# Altium schematic sheet Power_Supply.SchDoc
size A4
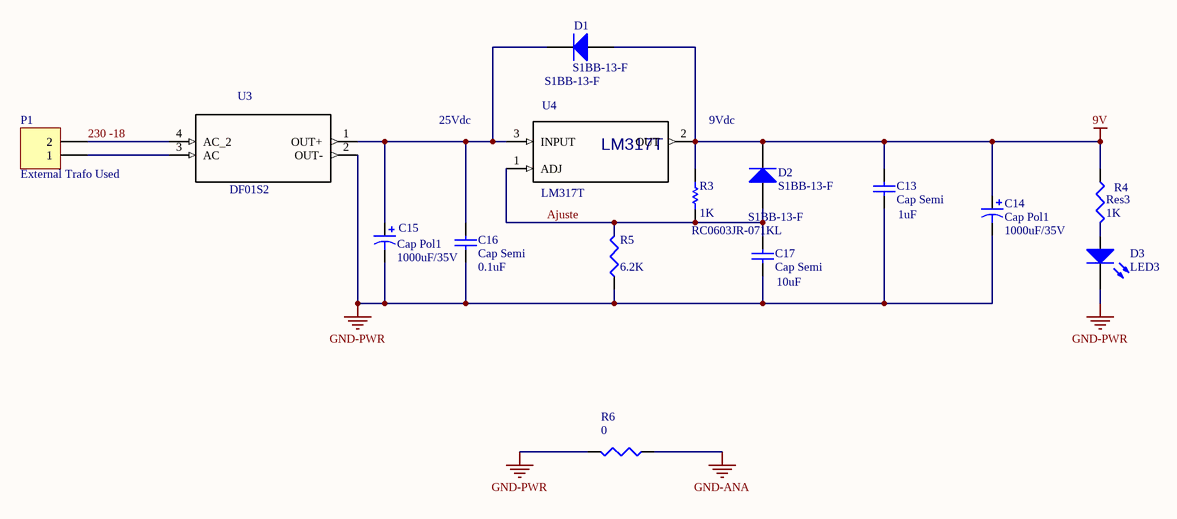
[diagram p0: Power_Supply.SchDoc]

## Parts
C13  Cap Semi  value 1uF  [1608[0603]]
C14  Cap Pol1  value 1000uF/35V  [RB7.6-15]
C15  Cap Pol1  value 1000uF/35V  [RB7.6-15]
C16  Cap Semi  value 0.1uF  [1608[0603]]
C17  Cap Semi  value 10uF  [1608[0603]]
D1  S1BB-13-F  [DIOM505270X240]
D2  S1BB-13-F  [DIOM505270X240]
D3  LED3  [6-0805_L]
P1  External Trafo Used  [PCBComponent_1]
R3  value 1K  PN: RC0603JR-071KL  [J1-0603]  (hidden comment: Res1)
R4  Res3  value 1K  [J1-0603]
R5  value 6.2K  [J1-0603]  (hidden comment: Res3)
R6  value 0  [6-0805_N]  (hidden comment: Res3)
U3  DF01S2  [SOT508P985X260-4N]
U4  LM317T  [TO254P460X1020X1945-3P]

## Nets
9V: C13.2 C14.1 D1.1(A) D2.2(K) R3.1 R4.1 U4.2(OUT)
GND-ANA: R6.1
GND-PWR: C13.1 C14.2 C15.2 C16.1 C17.1 D3.2(K) R5.1 R6.2 U3.2(OUT-)
230 -18: P1.2 U3.4(AC_2)
Ajuste: C17.2 D2.1(A) R3.2 R5.2 U4.1(ADJ)
NetC15_1: C15.1 C16.2 D1.2(K) U3.1(OUT+) U4.3(INPUT)
NetD3_1: D3.1(A) R4.2
NetP1_1: P1.1 U3.3(AC)

## Notes on the sheet
- 25Vdc
- 9Vdc

## Library data of the parts
C13 = Cap Semi: Capacitor (Semiconductor SIM Model) C1608JB1V105K080AB; PN: CL10A105KL8NNNC; Published: 8-Jun-2000; LatestRevisionDate: 29-May-2009; LatestRevisionNote: IPC-7351 Footprint Added.; PackageReference: C1206; Publisher: Altium Limited; PackageDescription: Chip Capacitor
C14 C15 = Cap Pol1: Polarized Capacitor (Radial) URS1V102MHD; Published: 8-Jun-2000; LatestRevisionDate: 17-Jul-2002; LatestRevisionNote: Re-released for DXP Platform.; PackageReference: RB7.6-15; Publisher: Altium Limited; PackageDescription: Polarized Capacitor (Radial); 2 Leads; PN: URS1V102MHD
C16 = Cap Semi: Capacitor (Semiconductor SIM Model) C0603T104J5RACTU; PN: CC0603JRX7R9BB104; Published: 8-Jun-2000; LatestRevisionDate: 29-May-2009; LatestRevisionNote: IPC-7351 Footprint Added.; PackageReference: C1206; Publisher: Altium Limited; PackageDescription: Chip Capacitor
C17 = Cap Semi: Capacitor (Semiconductor SIM Model) GRM188R6YA106MA73D; PN: C2012JB1V106K125AC; Published: 8-Jun-2000; LatestRevisionDate: 29-May-2009; LatestRevisionNote: IPC-7351 Footprint Added.; PackageReference: C1206; Publisher: Altium Limited; PackageDescription: Chip Capacitor
D1 D2 = Diode 1N4002: 100V 1 Amp General Purpose Rectifier; pin to pad: 1>A 2>C; Published: 8-Jun-2000; LatestRevisionDate: 17-Jul-2002; LatestRevisionNote: Re-released for DXP Platform.; DatasheetVersion: 1998; PackageVersion: Aug-1999; PackageReference: DO-41; Publisher: Altium Limited; PackageDescription: Diode, Axial; Body 5.2 x 2.7 mm (LxDia. max), Lead Dia. 0.86 mm (max); Code_JEDEC: DO-204-AL; ComponentLink1Description: Manufacturer Link; ComponentLink1URL: http://www.fairchildsemi.com/; ComponentLink2Description: Datasheet; ComponentLink2URL: http://www.fairchildsemi.com/ds/1N%2F1N4001.pdf; Supplier 1: Mouser; Supplier Part Number 1: 621-S1BB-F; PN: S1BB-13-F
D3 = LED3: Typical BLUE SiC LED IN-S85ATR; PN: SML-H12P8TT86C; Published: 8-Jun-2000; LatestRevisionDate: 17-Dec-2003; LatestRevisionNote: PCB Footprint replaced.; DatasheetVersion: 16-Apr-2002; PackageVersion: 16-Apr-2002; PackageReference: 3.5X2.8X1.9; Publisher: Altium Limited; PackageDescription: SM LED; 2 C-Bend Leads; Body 3.5 x 2.8 x 1.9 mm, inc leads (LxWxH typ)
P1 = MHDR1X2: Header, 2-Pin; LatestRevisionDate: 17-Jul-2002; LatestRevisionNote: Re-released for DXP Platform.; Publisher: Altium Limited
R3 = Res1: Resistor ERJ-PA3J102V; Published: 8-Jun-2000; LatestRevisionDate: 17-Jul-2002; LatestRevisionNote: Re-released for DXP Platform.; PackageReference: AXIAL-0.3; Publisher: Altium Limited; PackageDescription: Axial Device, Thru-Hole; 2 Leads; 0.3 in Pin Spacing
R4 = Res3: Resistor ERJ-PA3J102V; PN: RC0603JR-071KL; Published: 8-Jun-2000; LatestRevisionDate: 29-May-2009; LatestRevisionNote: IPC-7351 Footprint Added.; PackageReference: J1-0603; Publisher: Altium Limited; PackageDescription: Chip Resistor
R5 = Res3: Resistor ERJ-PA3J622V; Published: 8-Jun-2000; LatestRevisionDate: 29-May-2009; LatestRevisionNote: IPC-7351 Footprint Added.; PackageReference: J1-0603; Publisher: Altium Limited; PackageDescription: Chip Resistor; PN: ERJ-PA3J622V
R6 = Res3: Resistor; PN: CRCW08050000Z0EAC; Published: 8-Jun-2000; LatestRevisionDate: 29-May-2009; LatestRevisionNote: IPC-7351 Footprint Added.; PackageReference: J1-0603; Publisher: Altium Limited; PackageDescription: Chip Resistor
U3 = DF01S: DF01S Series 1.5 A 100 V 5 uA Surface Mount Bridge Rectifier -SDIP-4; MF: ON Semiconductor; SnapEDA_Link: https://www.snapeda.com/parts/DF01S/ON%20Semiconductor/view-part/?ref=snap; MP: DF01S2; Package: SMD-4 ON Semiconductor; Digi-Key_Purchase_URL: https://www.digikey.es/product-detail/en/diodes-incorporated/DF01S/DF01SDI-ND/149499?utm_source=snapeda&utm_medium=aggregator&utm_campaign=symbol; Digi-Key_Part_Number: DF01SDI-ND; Value: *
U4 = LM317T: MF: Texas Instruments; SnapEDA_Link: https://www.snapeda.com/parts/LM317T/Texas%20Instruments/view-part/?ref=snap; PN: LM317T; Package: TO-220-3 HTC Korea; Price: None; Availability: Unavailable; Value: *